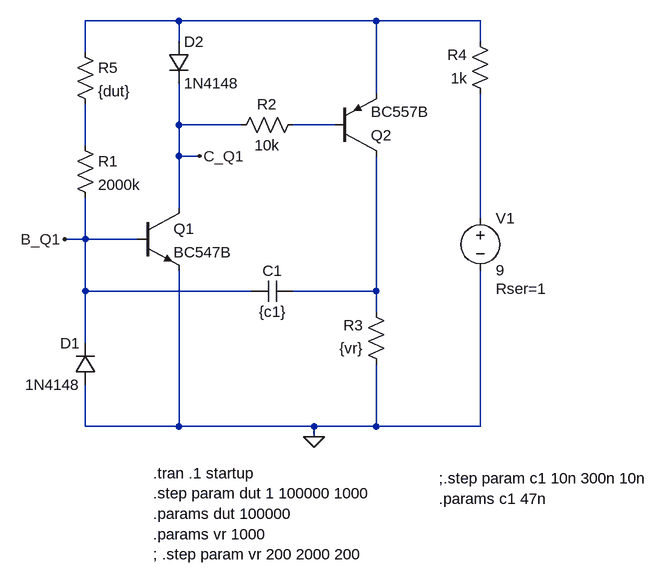
[diagram p0: schematic ContinuityTesterElektor1.asc]
ContinuityTesterElektor1.asc, the LTspice schematic file:
Version 4
SHEET 1 1068 760
WIRE 320 -64 176 -64
WIRE 624 -64 320 -64
WIRE 784 -64 624 -64
WIRE 320 -32 320 -64
WIRE 784 -32 784 -64
WIRE 176 -16 176 -64
WIRE 624 48 624 -64
WIRE 320 96 320 32
WIRE 416 96 320 96
WIRE 560 96 496 96
WIRE 176 128 176 64
WIRE 320 144 320 96
WIRE 352 144 320 144
WIRE 320 224 320 144
WIRE 784 240 784 48
WIRE 176 272 176 208
WIRE 176 272 144 272
WIRE 256 272 176 272
WIRE 176 352 176 272
WIRE 432 352 176 352
WIRE 624 352 624 144
WIRE 624 352 496 352
WIRE 624 384 624 352
WIRE 176 432 176 352
WIRE 176 560 176 496
WIRE 320 560 320 320
WIRE 320 560 176 560
WIRE 528 560 320 560
WIRE 624 560 624 464
WIRE 624 560 528 560
WIRE 784 560 784 320
WIRE 784 560 624 560
WIRE 528 576 528 560
FLAG 528 576 0
FLAG 144 272 B_Q1
FLAG 352 144 C_Q1
SYMBOL voltage 784 224 R0
WINDOW 123 0 0 Left 0
WINDOW 39 24 124 Left 2
SYMATTR SpiceLine Rser=1
SYMATTR InstName V1
SYMATTR Value 9
SYMBOL diode 192 496 R180
WINDOW 0 24 64 Left 2
WINDOW 3 24 0 Left 2
SYMATTR InstName D1
SYMATTR Value 1N4148
SYMBOL diode 304 -32 R0
SYMATTR InstName D2
SYMATTR Value 1N4148
SYMBOL res 160 112 R0
SYMATTR InstName R1
SYMATTR Value 2000k
SYMBOL res 512 80 R90
WINDOW 0 0 56 VBottom 2
WINDOW 3 32 56 VTop 2
SYMATTR InstName R2
SYMATTR Value 10k
SYMBOL res 640 480 R180
WINDOW 0 36 76 Left 2
WINDOW 3 36 40 Left 2
SYMATTR InstName R3
SYMATTR Value {vr}
SYMBOL res 800 64 R180
WINDOW 0 36 76 Left 2
WINDOW 3 36 40 Left 2
SYMATTR InstName R4
SYMATTR Value 1k
SYMBOL npn 256 224 R0
SYMATTR InstName Q1
SYMATTR Value BC547B
SYMBOL pnp 560 144 M180
SYMATTR InstName Q2
SYMATTR Value BC557B
SYMBOL cap 496 336 R90
WINDOW 0 0 32 VBottom 2
WINDOW 3 32 32 VTop 2
SYMATTR InstName C1
SYMATTR Value {c1}
SYMBOL res 160 -32 R0
SYMATTR InstName R5
SYMATTR Value {dut}
TEXT 280 632 Left 2 !.tran .1 startup\n.step param dut 1 100000 1000\n.params dut 100000\n.params vr 1000\n; .step param vr 200 2000 200
TEXT 720 640 Left 2 !;.step param c1 10n 300n 10n\n.params c1 47n

The netlist it stands for:
* ContinuityTesterElektor1.asc
V1 N004 0 9 Rser=1
D1 0 B_Q1 1N4148
D2 N001 C_Q1 1N4148
R1 N003 B_Q1 2000k
R2 N002 C_Q1 10k
R3 0 N005 {vr}
R4 N004 N001 1k
Q1 C_Q1 B_Q1 0 0 BC547B
Q2 N005 N002 N001 0 BC557B
C1 N005 B_Q1 {c1}
R5 N001 N003 {dut}
.model D D
.lib standard.dio
.model NPN NPN
.model PNP PNP
.lib standard.bjt
.tran .1 startup
.step param dut 1 100000 1000
.params dut 100000
.params vr 1000
; .step param vr 200 2000 200
;.step param c1 10n 300n 10n
.params c1 47n
.backanno
.end